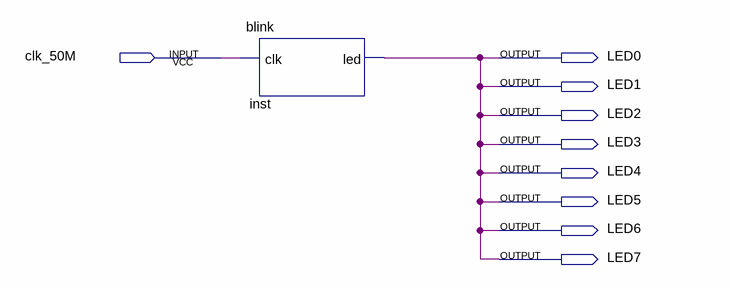
[diagram p0: schematic sheet]
// Quartus schematic top.bdf as structural Verilog: 1 symbols, 9 pins
module top (
  input  clk_50M,
  output LED0,
  output LED1,
  output LED2,
  output LED3,
  output LED4,
  output LED5,
  output LED6,
  output LED7
);

  blink inst (.clk(clk_50M), .led(LED0));

  assign LED1 = LED0;
  assign LED2 = LED0;
  assign LED3 = LED0;
  assign LED4 = LED0;
  assign LED5 = LED0;
  assign LED6 = LED0;
  assign LED7 = LED0;
endmodule
